# EAGLE schematic Artemis Charger Mod PCB.2 (EAGLE 7.5.0)
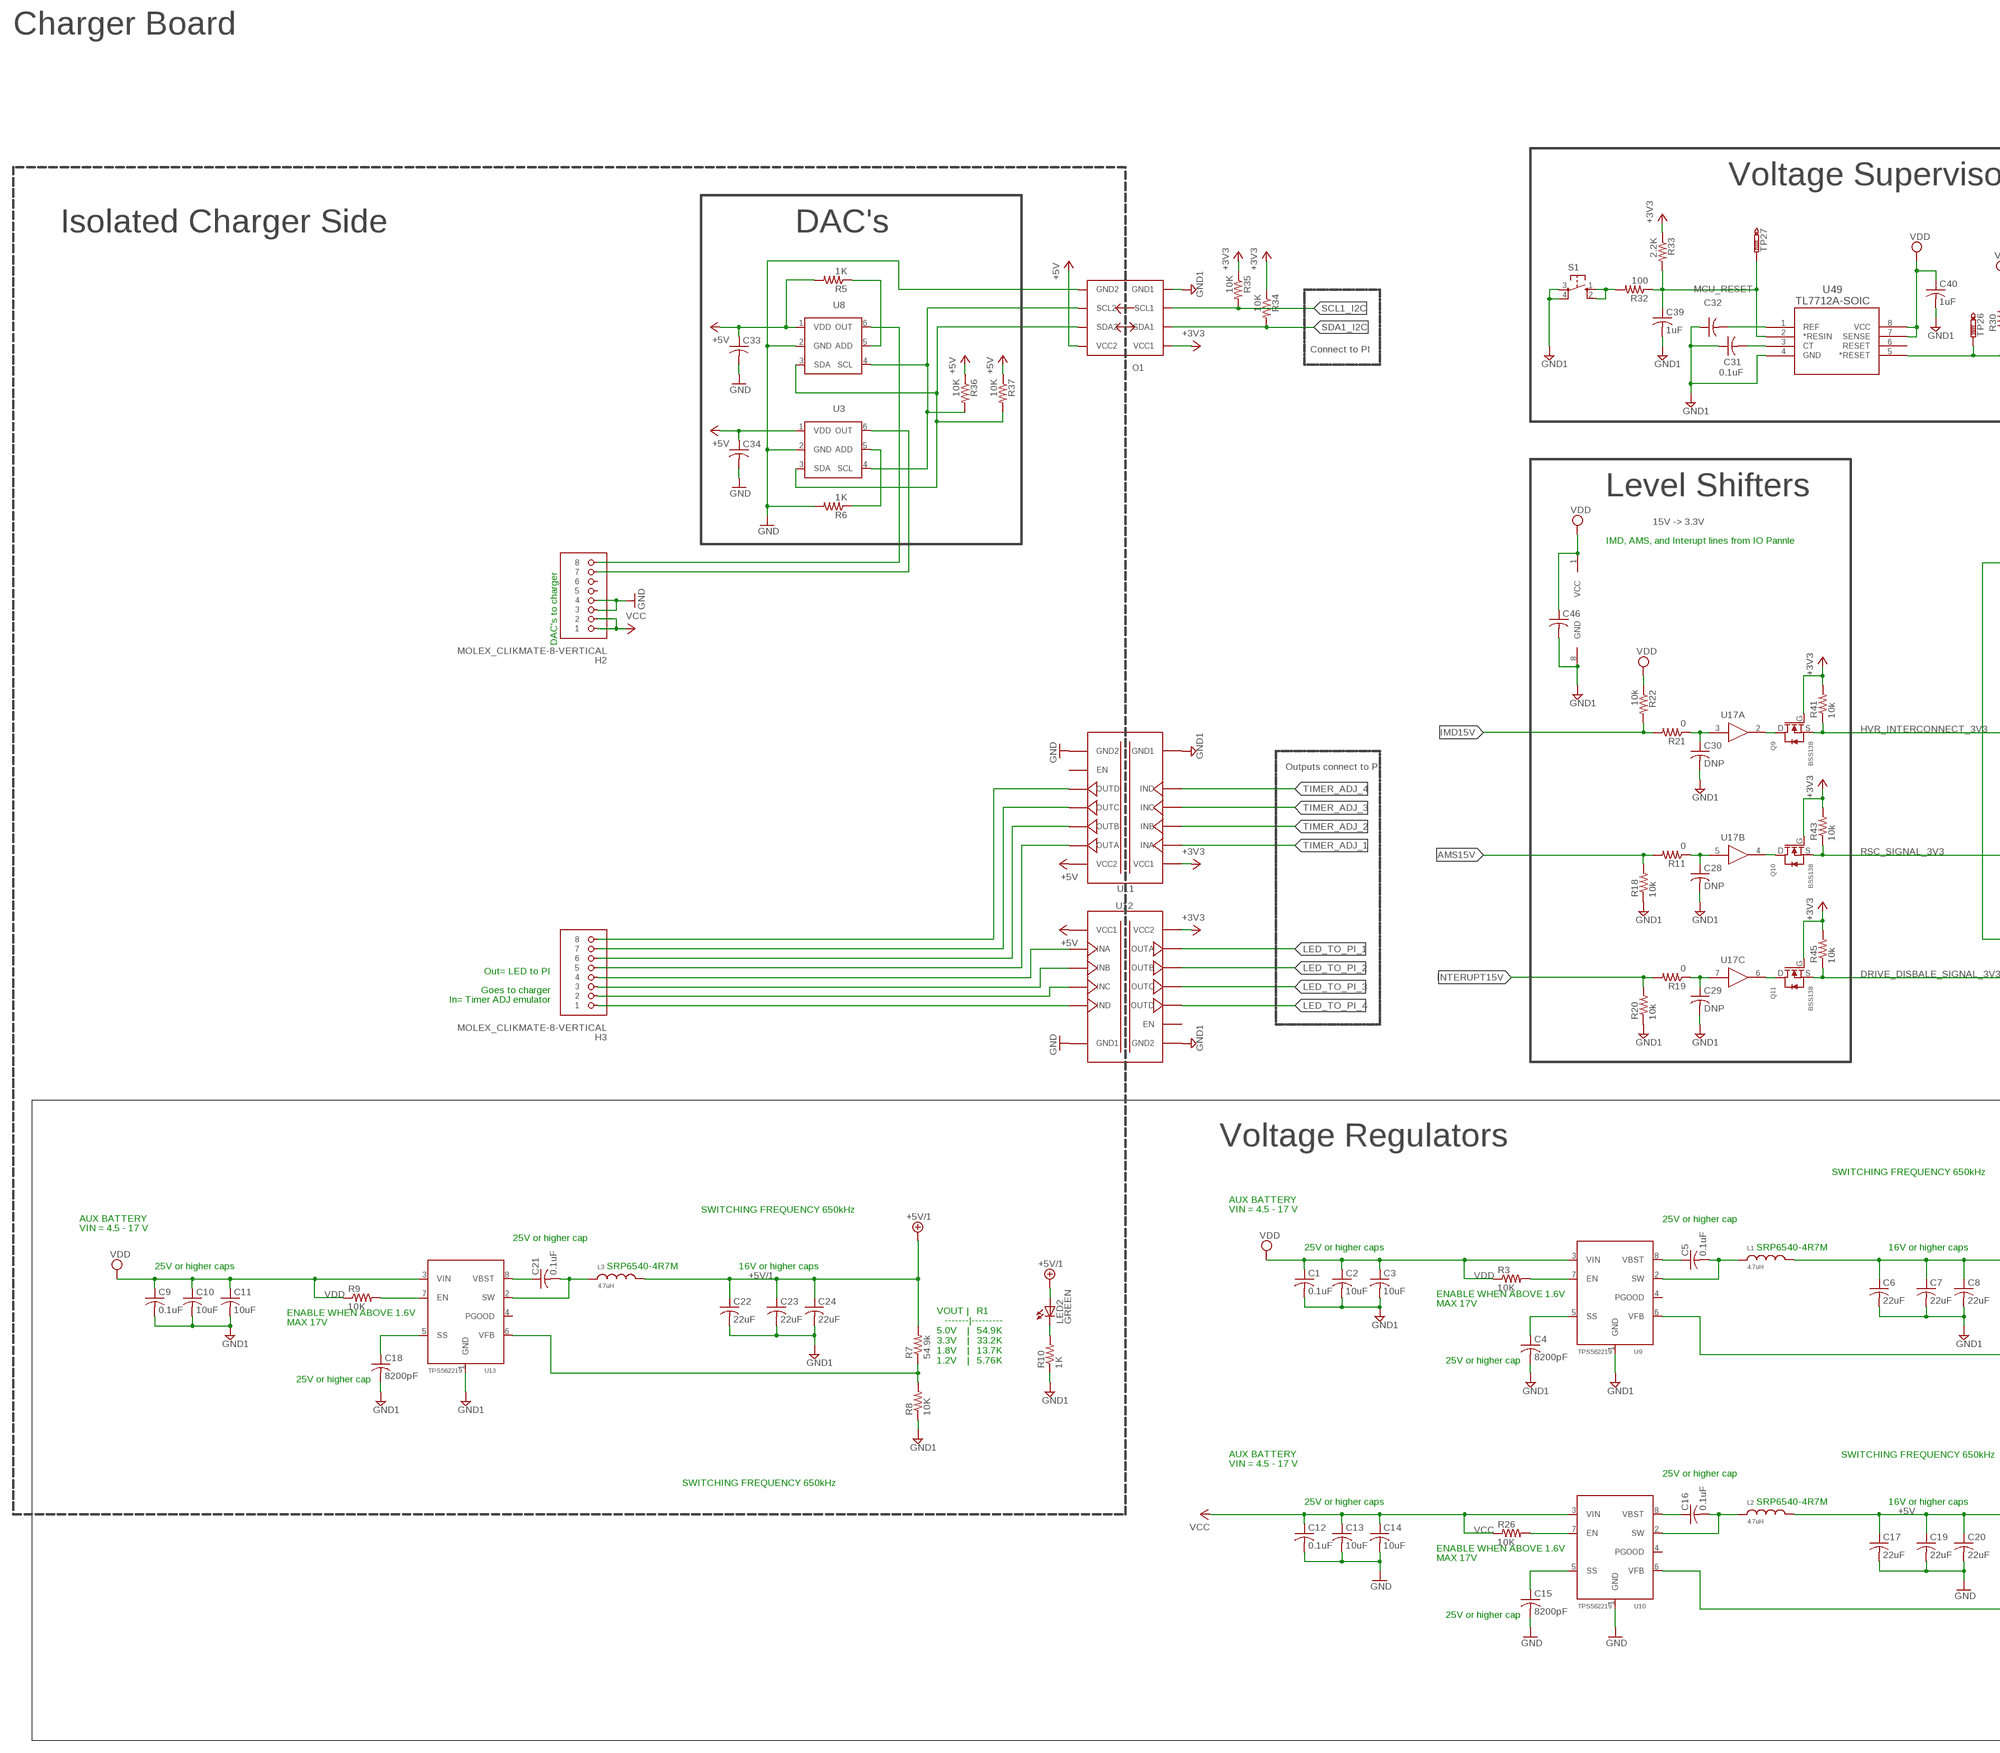
[diagram p0: schematic, sheet 1, part 1 of 2]
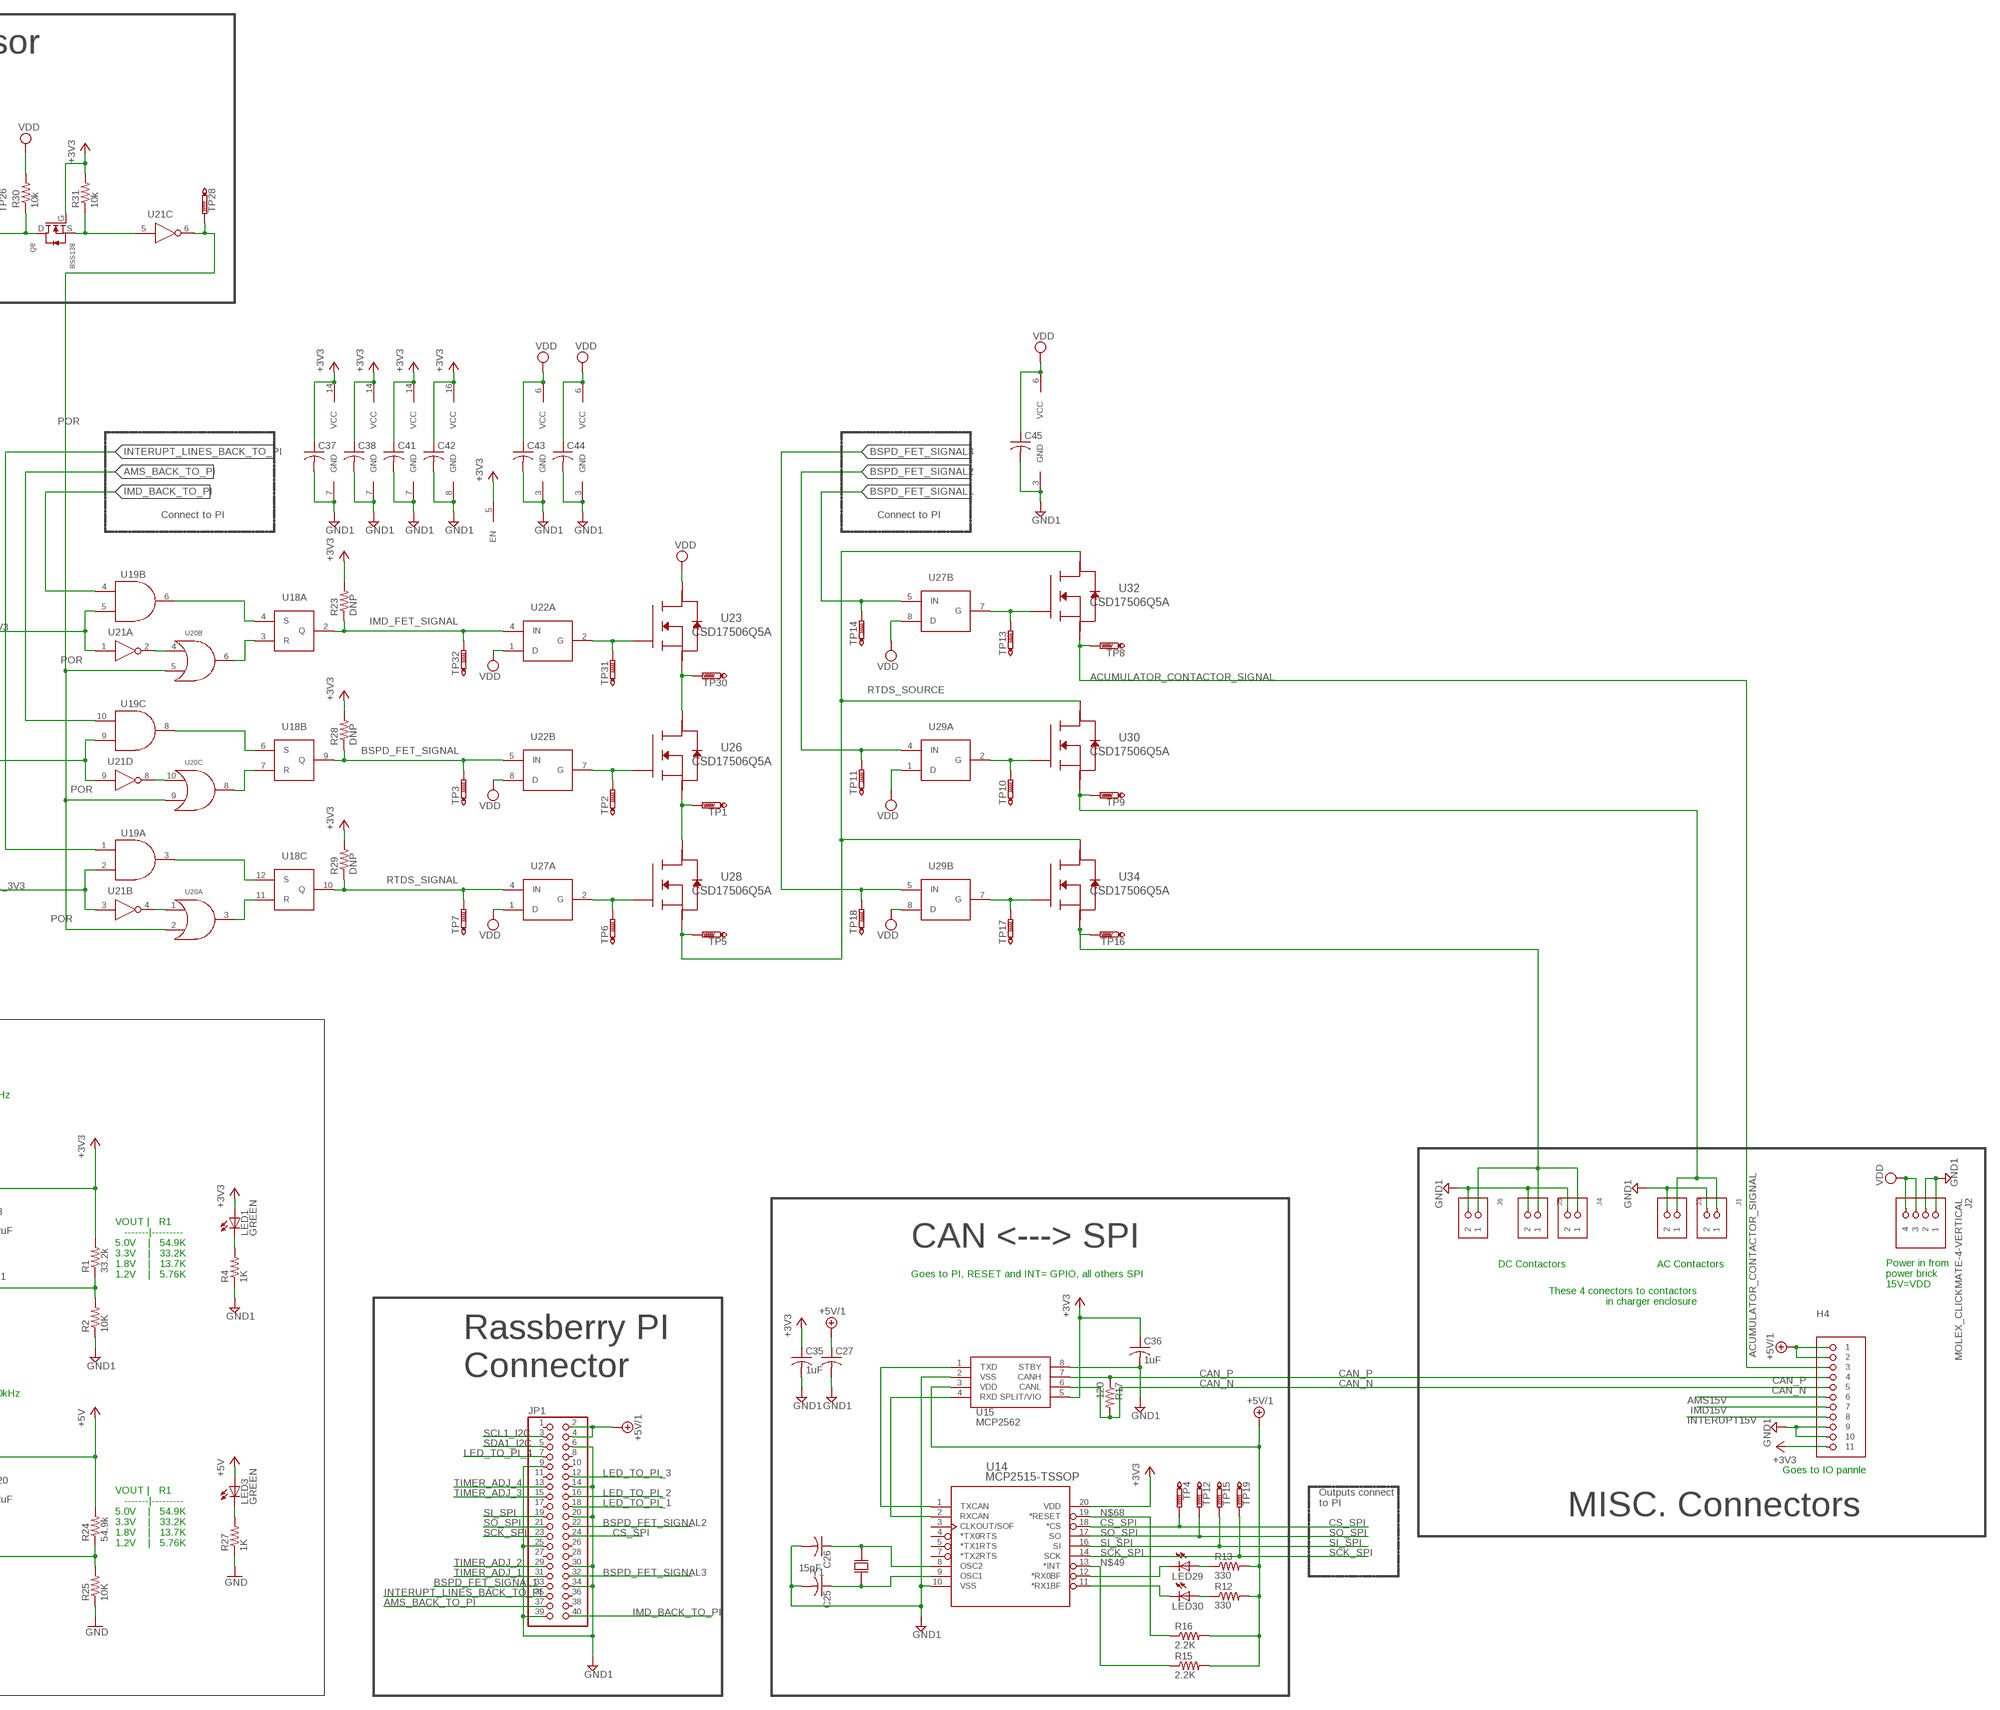
[diagram p1: schematic, sheet 1, part 2 of 2]

## Parts
C1  0.1uF  C-USC0805  [C0805]
C2  10uF  C-USC0805  [C0805]
C3  10uF  C-USC0805  [C0805]
C4  8200pF  C-USC0805  [C0805]
C5  0.1uF  C-USC0805  [C0805]
C6  22uF  C-USC0805  [C0805]
C7  22uF  C-USC0805  [C0805]
C8  22uF  C-USC0805  [C0805]
C9  0.1uF  C-USC0805  [C0805]
C10  10uF  C-USC0805  [C0805]
C11  10uF  C-USC0805  [C0805]
C12  0.1uF  C-USC0805  [C0805]
C13  10uF  C-USC0805  [C0805]
C14  10uF  C-USC0805  [C0805]
C15  8200pF  C-USC0805  [C0805]
C16  0.1uF  C-USC0805  [C0805]
C17  22uF  C-USC0805  [C0805]
C18  8200pF  C-USC0805  [C0805]
C19  22uF  C-USC0805  [C0805]
C20  22uF  C-USC0805  [C0805]
C21  0.1uF  C-USC0805  [C0805]
C22  22uF  C-USC0805  [C0805]
C23  22uF  C-USC0805  [C0805]
C24  22uF  C-USC0805  [C0805]
C25  15pF  C-USC0805  [C0805]
C26  15pF  C-USC0805  [C0805]
C27  0.1uF  C-USC0805  [C0805]
C28  DNP  C-USC0805  [C0805]
C29  DNP  C-USC0805  [C0805]
C30  DNP  C-USC0805  [C0805]
C31  0.1uF  C-USC0805  [C0805]
C32  0.1uF  C-USC0805  [C0805]
C33  0.1uF  C-USC0805  [C0805]
C34  0.1uF  C-USC0805  [C0805]
C35  1uF  C-USC0805  [C0805]
C36  1uF  C-USC0805  [C0805]
C37  0.1uF  C-USC0805  [C0805]
C38  0.1uF  C-USC0805  [C0805]
C39  1uF  C-USC0805  [C0805]
C40  1uF  C-USC0805  [C0805]
C41  0.1uF  C-USC0805  [C0805]
C42  0.1uF  C-USC0805  [C0805]
C43  0.1uF  C-USC0805  [C0805]
C44  0.1uF  C-USC0805  [C0805]
C45  0.1uF  C-USC0805  [C0805]
C46  0.1uF  C-USC0805  [C0805]
H2  MOLEX_CLIKMATE-8-VERTICAL  [MOLEX-CLIKMATE-8-VERTICAL-HEADER]
H3  MOLEX_CLIKMATE-8-VERTICAL  [MOLEX-CLIKMATE-8-VERTICAL-HEADER]
H4  MOLEX_CLICKMATE-11-VERTICAL-VERTICAL  [MOLEX_CLICKMATE-11-VERTICAL-HEADER]
J1  MOLEX_CLICKMATE-2-VERTICAL  [MOLEX-CLIKMATE-2-VERTICAL-HEADER]
J2  MOLEX_CLICKMATE-4-VERTICAL  [MOLEX-CLIKMATE-4-VERTICAL-HEADER]
J3  MOLEX_CLICKMATE-2-VERTICAL  [MOLEX-CLIKMATE-2-VERTICAL-HEADER]
J4  MOLEX_CLICKMATE-2-VERTICAL  [MOLEX-CLIKMATE-2-VERTICAL-HEADER]
J5  MOLEX_CLICKMATE-2-VERTICAL  [MOLEX-CLIKMATE-2-VERTICAL-HEADER]
J6  MOLEX_CLICKMATE-2-VERTICAL  [MOLEX-CLIKMATE-2-VERTICAL-HEADER]
JP1  PINHD-2X20  [2X20]
L1  4.7uH  SRP6540  [SRP6540]
L2  4.7uH  SRP6540  [SRP6540]
L3  4.7uH  SRP6540  [SRP6540]
LED1  GREEN  LEDCHIPLED_0805  [CHIPLED_0805]
LED2  GREEN  LEDCHIPLED_0805  [CHIPLED_0805]
LED3  GREEN  LEDCHIPLED_0805  [CHIPLED_0805]
LED29  LEDCHIP-LED0805  [CHIP-LED0805]
LED30  LEDCHIP-LED0805  [CHIP-LED0805]
O1  ISO1541  [ISO1541]
Q8  BSS138  [BSS138]
Q9  BSS138  [BSS138]
Q10  BSS138  [BSS138]
Q11  BSS138  [BSS138]
R1  33.2k  R-US_R0805  [R0805]
R2  10K  R-US_R0805  [R0805]
R3  10K  R-US_R0805  [R0805]
R4  1K  R-US_R0805  [R0805]
R5  1K  R-US_R0805  [R0805]
R6  1K  R-US_R0805  [R0805]
R7  54.9k  R-US_R0805  [R0805]
R8  10K  R-US_R0805  [R0805]
R9  10K  R-US_R0805  [R0805]
R10  1K  R-US_R0805  [R0805]
R11  0  R-US_R0805  [R0805]
R12  330  R-US_R0805  [R0805]
R13  330  R-US_R0805  [R0805]
R15  2.2K  R-US_R0805  [R0805]
R16  2.2K  R-US_R0805  [R0805]
R17  120  R-US_R0805  [R0805]
R18  10k  R-US_R0805  [R0805]
R19  0  R-US_R0805  [R0805]
R20  10k  R-US_R0805  [R0805]
R21  0  R-US_R0805  [R0805]
R22  10k  R-US_R0805  [R0805]
R23  DNP  R-US_R0805  [R0805]
R24  54.9k  R-US_R0805  [R0805]
R25  10K  R-US_R0805  [R0805]
R26  10K  R-US_R0805  [R0805]
R27  1K  R-US_R0805  [R0805]
R28  DNP  R-US_R0805  [R0805]
R29  DNP  R-US_R0805  [R0805]
R30  10k  R-US_R0805  [R0805]
R31  10k  R-US_R0805  [R0805]
R32  100  R-US_R0805  [R0805]
R33  2.2K  R-US_R0805  [R0805]
R34  10K  R-US_R0805  [R0805]
R35  10K  R-US_R0805  [R0805]
R36  10K  R-US_R0805  [R0805]
R37  10K  R-US_R0805  [R0805]
R41  10k  R-US_R0805  [R0805]
R43  10k  R-US_R0805  [R0805]
R45  10k  R-US_R0805  [R0805]
S1  TE-FSM4JSMATR  [TE-FSM4JSMATR]
TP1  PTR1TP20R  [TP20R]
TP2  PTR1TP20R  [TP20R]
TP3  PTR1TP20R  [TP20R]
TP4  PTR1TP20R  [TP20R]
TP5  PTR1TP20R  [TP20R]
TP6  PTR1TP20R  [TP20R]
TP7  PTR1TP20R  [TP20R]
TP8  PTR1TP20R  [TP20R]
TP9  PTR1TP20R  [TP20R]
TP10  PTR1TP20R  [TP20R]
TP11  PTR1TP20R  [TP20R]
TP12  PTR1TP20R  [TP20R]
TP13  PTR1TP20R  [TP20R]
TP14  PTR1TP20R  [TP20R]
TP15  PTR1TP20R  [TP20R]
TP16  PTR1TP20R  [TP20R]
TP17  PTR1TP20R  [TP20R]
TP18  PTR1TP20R  [TP20R]
TP19  PTR1TP20R  [TP20R]
TP26  PTR1TP20R  [TP20R]
TP27  PTR1TP20R  [TP20R]
TP28  PTR1TP20R  [TP20R]
TP30  PTR1TP20R  [TP20R]
TP31  PTR1TP20R  [TP20R]
TP32  PTR1TP20R  [TP20R]
U3  MAX5812LEUT+TCT-ND  MAX5812M  [MAX5812]
U8  MAX5812LEUT+TCT-ND  MAX5812M  [MAX5812]
U9  TPS562219  [TPS562219]
U10  TPS562219  [TPS562219]
U11  ISO7340  [ISO734X]
U12  ISO7340  [ISO734X]
U13  TPS562219  [TPS562219]
U14  MCP2515-TSSOP  [TSSOP20_MC]
U15  MCP2562  MCP256X-SOIC  [SOIC8-N_MC]
U17  CD4050BD  [SOIC-16]
U18  CD4043B  [PW16-M]
U19  SN74LVC08ASOIC  [D14]
U20  SN74LVC32ASOIC  [D14]
U21  SN74LVC04ASOIC  [SOIC-14]
U22  LTC1155  [LT-SOL8]
U23  CSD17506Q5A  [SON_5X6]
U26  CSD17506Q5A  [SON_5X6]
U27  LTC1155  [LT-SOL8]
U28  CSD17506Q5A  [SON_5X6]
U29  LTC1155  [LT-SOL8]
U30  CSD17506Q5A  [SON_5X6]
U32  CSD17506Q5A  [SON_5X6]
U34  CSD17506Q5A  [SON_5X6]
U49  TL7712A-SOIC  TL7709A-SOIC  [D8]
Y1  CSM-3X  [CSM-3X]

## Nets
+3V3: C6.1 C7.1 C8.1 C35.1 C36.1 C37.1 C38.1 C41.1 C42.1 H4.11 L1.P$2 LED1.A O1.1(VCC1) Q8.G Q9.G Q10.G Q11.G R1.2 R23.2 R28.2 R29.2 R31.2 R33.1 R34.1 R35.1 R41.2 R43.2 R45.2 U11.P$1(VCC1) U12.P$16(VCC2) U14.20(VDD) U15.5(SPLIT/VIO) U18.5(EN:EN) U18.16(P:VCC) U19.14(P:VCC) U20.14(P:VCC) U21.14(POWER:VCC)
+5V: C17.1 C19.1 C20.1 C33.1 C34.1 L2.P$2 LED3.A O1.8(VCC2) R5.2 R24.2 R36.1 R37.1 U3.1(VDD) U8.1(VDD) U11.P$16(VCC2) U12.P$1(VCC1)
+5V/1: C22.1 C23.1 C24.1 C27.1 H4.1 H4.2 JP1.2 JP1.4 L3.P$2 LED2.A R7.2 R12.2 R13.2 R15.2 R16.2 U15.3(VDD)
ACUMULATOR_CONTACTOR_SIGNAL: H4.3 TP8.TP U32.1(S) U32.2(S) U32.3(S)
ADD: R6.1 U3.5(ADD)
AMS15V: H4.6 R11.2 R18.2
AMS_15V_FILTERED: Q10.D U17.4(B:OUT)
AMS_BACK_TO_PI: JP1.37 U19.10(C:IN1)
BSPD_FET_SIGNAL: R28.1 TP3.TP U18.9(B:Q) U22.5(B:IN)
BSPD_FET_SIGNAL1: JP1.33 TP14.TP U27.5(B:IN)
BSPD_FET_SIGNAL2: JP1.22 TP11.TP U29.4(A:IN)
BSPD_FET_SIGNAL3: JP1.32 TP18.TP U29.5(B:IN)
CAN_N [CAN]: H4.5 R17.2 U15.6(CANL)
CAN_P [CAN]: H4.4 R17.1 U15.7(CANH)
CS_SPI: JP1.24 TP4.TP U14.18(*CS)
DRIVE_DISBALE_SIGNAL_3V3: Q11.S R45.1 U19.2(A:IN2) U21.3(B:IN)
FET_CONNECT_1: TP30.TP U23.1(S) U23.2(S) U23.3(S) U26.5(D) U26.6(D) U26.7(D) U26.8(D) U26.PAD1(D) U26.PAD(D) U26.VIA1(D) U26.VIA2(D) U26.VIA3(D) U26.VIA4(D) U26.VIA5(D) U26.VIA6(D) U26.VIA7(D) U26.VIA8(D) U26.VIA9(D)
FET_CONNECT_2: TP1.TP U26.1(S) U26.2(S) U26.3(S) U28.5(D) U28.6(D) U28.7(D) U28.8(D) U28.PAD1(D) U28.PAD(D) U28.VIA1(D) U28.VIA2(D) U28.VIA3(D) U28.VIA4(D) U28.VIA5(D) U28.VIA6(D) U28.VIA7(D) U28.VIA8(D) U28.VIA9(D)
GND: C12.2 C13.2 C14.2 C15.2 C17.2 C19.2 C20.2 C33.2 C34.2 H2.3 H2.4 O1.5(GND2) R6.2 R25.1 R27.1 U3.2(GND) U8.2(GND) U10.1(GND) U11.P$9(GND2) U11.P$15(GND2) U12.P$2(GND1) U12.P$8(GND1)
GND1: C1.2 C2.2 C3.2 C4.2 C6.2 C7.2 C8.2 C9.2 C10.2 C11.2 C18.2 C22.2 C23.2 C24.2 C25.2 C26.2 C27.2 C28.2 C29.2 C30.2 C31.1 C32.1 C35.2 C36.2 C37.2 C38.2 C39.2 C40.2 C41.2 C42.2 C43.2 C44.2 C45.2 C46.2 H4.9 H4.10 J1.2 J2.1 J2.2 J3.2 J4.2 J5.2 J6.2 JP1.6 JP1.9 JP1.14 JP1.20 JP1.25 JP1.30 JP1.34 JP1.39 O1.4(GND1) R2.1 R4.1 R8.1 R10.1 R18.1 R20.1 S1.3 S1.4 U9.1(GND) U11.P$2(GND1) U11.P$8(GND1) U12.P$9(GND2) U12.P$15(GND2) U13.1(GND) U14.10(VSS) U15.2(VSS) U15.8(STBY) U17.8(POWER:GND) U18.8(P:GND) U19.7(P:GND) U20.7(P:GND) U21.7(POWER:GND) U22.3(P:GND) U27.3(P:GND) U29.3(P:GND) U49.4(GND)
HVR_INTERCONNECT_3V3: Q9.S R41.1 U19.5(B:IN2) U21.1(A:IN)
IMD15V: H4.7 R21.2 R22.2
IMD_15V_FILTERED: Q9.D U17.2(A:OUT)
IMD_BACK_TO_PI: JP1.40 U19.4(B:IN1)
IMD_FET_SIGNAL: R23.1 TP32.TP U18.2(A:Q) U22.4(A:IN)
INTERUPT15V: H4.8 R19.2 R20.2
INTERUPT_LINES_15V_FILTERED: Q11.D U17.6(C:OUT)
INTERUPT_LINES_BACK_TO_PI: JP1.35 U19.1(A:IN1)
LED_TO_PI_1: JP1.18 U12.P$14(OUTA)
LED_TO_PI_1_C: H3.1 U12.P$6(IND)
LED_TO_PI_2: JP1.16 U12.P$13(OUTB)
LED_TO_PI_2_C: H3.2 U12.P$5(INC)
LED_TO_PI_3: JP1.12 U12.P$12(OUTC)
LED_TO_PI_3_C: H3.3 U12.P$4(INB)
LED_TO_PI_4: JP1.7 U12.P$11(OUTD)
LED_TO_PI_4_C: H3.4 U12.P$3(INA)
MCU_RESET: C39.1 R32.1 R33.2 TP27.TP U49.2(*RESIN)
N$1: R3.2 U9.7(EN)
N$2: LED1.C R4.2
N$4: R5.1 U8.5(ADD)
N$6: J4.1 J5.1 J6.1 TP16.TP U34.1(S) U34.2(S) U34.3(S)
N$8: U20.1(A:IN1) U21.4(B:OUT)
N$9: U20.4(B:IN1) U21.2(A:OUT)
N$13: U18.12(C:S) U19.3(A:OUT)
N$17: U18.11(C:R) U20.3(A:OUT)
N$19: U18.3(A:R) U20.6(B:OUT)
N$20: U18.4(A:S) U19.6(B:OUT)
N$21: U20.10(C:IN1) U21.8(D:OUT)
N$22: U18.6(B:S) U19.8(C:OUT)
N$23: U18.7(B:R) U20.8(C:OUT)
N$25: H2.7 U3.6(OUT)
N$26: H2.8 U8.6(OUT)
N$28: LED3.C R27.2
N$30: H3.5 U11.P$14(OUTA)
N$31: H3.6 U11.P$13(OUTB)
N$32: H3.7 U11.P$12(OUTC)
N$33: H3.8 U11.P$11(OUTD)
N$43: C28.1 R11.1 U17.5(B:IN)
N$44: R9.2 U13.7(EN)
N$45: LED2.C R10.2
N$46: U14.2(RXCAN) U15.4(RXD)
N$47: U14.1(TXCAN) U15.1(TXD)
N$49: R15.1 U14.13(*INT)
N$50: C29.1 R19.1 U17.7(C:IN)
N$53: C30.1 R21.1 U17.3(A:IN)
N$54: TP31.TP U22.2(A:G) U23.4(G)
N$55: TP2.TP U22.7(B:G) U26.4(G)
N$56: TP6.TP U27.2(A:G) U28.4(G)
N$57: TP10.TP U29.2(A:G) U30.4(G)
N$58: Q8.S R31.1 U21.5(C:IN)
N$59: TP13.TP U27.7(B:G) U32.4(G)
N$61: Q8.D R30.1 TP26.TP U49.5(*RESET)
N$62: R32.2 S1.1 S1.2
N$64: TP17.TP U29.7(B:G) U34.4(G)
N$68: R16.1 U14.19(*RESET)
N$77: LED30.C U14.11(*RX1BF)
N$80: LED29.C U14.12(*RX0BF)
N$99: LED30.A R12.1
N$100: LED29.A R13.1
N$123: C26.1 U14.8(OSC2) Y1.P$1
N$124: C25.1 U14.9(OSC1) Y1.P$2
N$189: C31.2 U49.3(CT)
N$190: C32.2 U49.1(REF)
N$1001: R26.2 U10.7(EN)
POR: TP28.TP U20.2(A:IN2) U20.5(B:IN2) U20.9(C:IN2) U21.6(C:OUT)
RSC_SIGNAL_3V3: Q10.S R43.1 U19.9(C:IN2) U21.9(D:IN)
RTDS_SIGNAL: R29.1 TP7.TP U18.10(C:Q) U27.4(A:IN)
RTDS_SOURCE: TP5.TP U28.1(S) U28.2(S) U28.3(S) U30.5(D) U30.6(D) U30.7(D) U30.8(D) U30.PAD1(D) U30.PAD(D) U30.VIA1(D) U30.VIA2(D) U30.VIA3(D) U30.VIA4(D) U30.VIA5(D) U30.VIA6(D) U30.VIA7(D) U30.VIA8(D) U30.VIA9(D) U32.5(D) U32.6(D) U32.7(D) U32.8(D) U32.PAD1(D) U32.PAD(D) U32.VIA1(D) U32.VIA2(D) U32.VIA3(D) U32.VIA4(D) U32.VIA5(D) U32.VIA6(D) U32.VIA7(D) U32.VIA8(D) U32.VIA9(D) U34.5(D) U34.6(D) U34.7(D) U34.8(D) U34.PAD1(D) U34.PAD(D) U34.VIA1(D) U34.VIA2(D) U34.VIA3(D) U34.VIA4(D) U34.VIA5(D) U34.VIA6(D) U34.VIA7(D) U34.VIA8(D) U34.VIA9(D)
RTDS_SOURCE1: J1.1 J3.1 TP9.TP U30.1(S) U30.2(S) U30.3(S)
SCK_SPI: JP1.23 TP19.TP U14.14(SCK)
SCL: O1.6(SCL2) R36.2 U3.4(SCL) U8.4(SCL)
SCL1_I2C: JP1.3 O1.3(SCL1) R35.2
SDA: O1.7(SDA2) R37.2 U3.3(SDA) U8.3(SDA)
SDA1_I2C: JP1.5 O1.2(SDA1) R34.2
SI_SPI: JP1.19 TP15.TP U14.16(SI)
SO_SPI: JP1.21 TP12.TP U14.17(SO)
SS_3V3: C4.1 U9.5(SS)
SS_5V: C15.1 U10.5(SS)
SS_5V2: C18.1 U13.5(SS)
SW_3V3: C5.2 L1.P$1 U9.2(SW)
SW_5V: C16.2 L2.P$1 U10.2(SW)
SW_5V/1: C21.2 L3.P$1 U13.2(SW)
TIMER_ADJ_1: JP1.31 U11.P$3(INA)
TIMER_ADJ_2: JP1.29 U11.P$4(INB)
TIMER_ADJ_3: JP1.15 U11.P$5(INC)
TIMER_ADJ_4: JP1.13 U11.P$6(IND)
VBST_3V3: C5.1 U9.8(VBST)
VBST_5V: C16.1 U10.8(VBST)
VBST_5V/1: C21.1 U13.8(VBST)
VCC: C12.1 C13.1 C14.1 H2.1 H2.2 R26.1 U10.3(VIN)
VDD: C1.1 C2.1 C3.1 C9.1 C10.1 C11.1 C40.1 C43.1 C44.1 C45.1 C46.1 J2.3 J2.4 R3.1 R9.1 R22.1 R30.2 U9.3(VIN) U13.3(VIN) U17.1(POWER:VCC) U22.1(A:D) U22.6(P:VCC) U22.8(B:D) U23.5(D) U23.6(D) U23.7(D) U23.8(D) U23.PAD1(D) U23.PAD(D) U23.VIA1(D) U23.VIA2(D) U23.VIA3(D) U23.VIA4(D) U23.VIA5(D) U23.VIA6(D) U23.VIA7(D) U23.VIA8(D) U23.VIA9(D) U27.1(A:D) U27.6(P:VCC) U27.8(B:D) U29.1(A:D) U29.6(P:VCC) U29.8(B:D) U49.7(SENSE) U49.8(VCC)
VFB_3V3: R1.1 R2.2 U9.6(VFB)
VFB_5V: R24.1 R25.2 U10.6(VFB)
VFB_5V/1: R7.1 R8.2 U13.6(VFB)
Unconnected: H2.5 H2.6 JP1.1 JP1.8 JP1.10 JP1.11 JP1.17 JP1.26 JP1.27 JP1.28 JP1.36 JP1.38 U9.4(PGOOD) U10.4(PGOOD) U11.P$10(EN) U12.P$10(EN) U13.4(PGOOD) U14.3(CLKOUT/SOF) U14.4(*TX0RTS) U14.5(*TX1RTS) U14.7(*TX2RTS) U17.9(D:IN) U17.10(D:OUT) U17.11(E:IN) U17.12(E:OUT) U17.14(F:IN) U17.15(F:OUT) U18.1(D:Q) U18.14(D:S) U18.15(D:R) U19.11(D:OUT) U19.12(D:IN2) U19.13(D:IN1) U20.11(D:OUT) U20.12(D:IN2) U20.13(D:IN1) U21.10(E:OUT) U21.11(E:IN) U21.12(F:OUT) U21.13(F:IN) U49.6(RESET)

## Notes on the sheet
- Charger Board
- Voltage Supervisor
- Isolated Charger Side | DAC's
- Connect to PI
- Level Shifters
- 15V -> 3.3V
- IMD, AMS, and Interupt lines from IO Pannle
- DAC's to charger
- Connect to PI | Connect to PI
- Outputs connect to PI
- Out= LED to PI
- Goes to charger
  In= Timer ADJ emulator
- Voltage Regulators
- SWITCHING FREQUENCY 650kHz
- SWITCHING FREQUENCY 650kHz
- AUX BATTERY
  VIN = 4.5 - 17 V
- 25V or higher cap
- AUX BATTERY
  VIN = 4.5 - 17 V
- 25V or higher cap
- 25V or higher caps | SRP6540-4R7M | 16V or higher caps
- 25V or higher caps | SRP6540-4R7M | 16V or higher caps
- ENABLE WHEN ABOVE 1.6V
  MAX 17V
- CAN <---> SPI
- ENABLE WHEN ABOVE 1.6V
  MAX 17V
- DC Contactors | AC Contactors
- VOUT |   R1
     -------|---------
  5.0V    |   54.9K
  3.3V    |   33.2K
  1.8V    |   13.7K
  1.2V    |   5.76K
- Goes to PI, RESET and INT= GPIO, all others SPI
- These 4 conectors to contactors
        in charger enclosure
- Power in from
  power brick
  15V=VDD
- VOUT |   R1
     -------|---------
  5.0V    |   54.9K
  3.3V    |   33.2K
  1.8V    |   13.7K
  1.2V    |   5.76K
- 25V or higher cap
- 25V or higher cap
- Rassberry PI
  Connector
- SWITCHING FREQUENCY 650kHz
- AUX BATTERY
  VIN = 4.5 - 17 V
- 25V or higher cap
- SWITCHING FREQUENCY 650kHz
- 25V or higher caps | SRP6540-4R7M | 16V or higher caps
- Goes to IO pannle
- ENABLE WHEN ABOVE 1.6V
  MAX 17V
- Outputs connect
  to PI
- MISC. Connectors
- VOUT |   R1
     -------|---------
  5.0V    |   54.9K
  3.3V    |   33.2K
  1.8V    |   13.7K
  1.2V    |   5.76K
- 25V or higher cap

## Library data of the parts
C1 C5 C12 C16 C21 = adafruit:C-US: CAPACITOR, American symbol; PARTNO: GRM21BR71E104KA01L
C2 C3 C10 C11 C13 C14 = adafruit:C-US: CAPACITOR, American symbol; PARTNO: GRM21BR61E106KA73L
C4 C15 C18 = adafruit:C-US: CAPACITOR, American symbol; PARTNO: C0805C822K5RACTU
C6-C8 C17 C19 C20 C22-C24 = adafruit:C-US: CAPACITOR, American symbol; PARTNO: C2012JB1E226M125AC
C9 = adafruit:C-US: CAPACITOR, American symbol; PARTNO: 5025841170
C25 C26 = rcl:C-US: CAPACITOR, American symbol; MPN: 08051A150JAT2A; OC_NEWARK: 96M1322; PARTNO: CL21C150JBANNNC
C27 C33 C34 C37 C38 C41-C46 = rcl:C-US: CAPACITOR, American symbol; MPN: C1005X7R1E104K050BB; OC_NEWARK: 04X3227; PARTNO: GRM21BR71E104KA01L
C28-C30 = rcl:C-US: CAPACITOR, American symbol
C31 C32 = adafruit:C-US: CAPACITOR, American symbol; MPN: C2012X7R1H104K085AA; OC_NEWARK: 04X3288; PARTNO: GRM21BR71E104KA01L
C35 C36 C39 C40 = rcl:C-US: CAPACITOR, American symbol; PARTNO: EMK212B7105KG-T
H2 H3 = FormE:MOLEX_CLIKMATE-8-VERTICAL: 505405-0860; PARTNO: 5025840870
H4 = FormE:MOLEX_CLICKMATE-11-VERTICAL; PARTNO: 5025841170
J1 J3-J6 = FormE:MOLEX_CLICKMATE-2-VERTICAL: 5025840270; PARTNO: 5025840270
J2 = FormE:MOLEX_CLICKMATE-4-VERTICAL: 5025840470; PARTNO: 5040500491
JP1 = pinhead:PINHD-2X20: PIN HEADER; PARTNO: 68602-220HLF
L1-L3 = FormE:SRP6540; PARTNO: SRP6540-4R7M
LED1-LED3 = FormE:LED: LED OSRAM: - CHIPLED LG R971, LG N971, LY N971, LG Q971, LY Q971, LO R971, LY R971 LH N974, LH R974 LS Q976, LO Q976, LY Q976 LO Q996 - Hyper CHIPLED LW Q18S LB Q993, LB Q99A, LB R99A - SideLED LS A670, LO A670, LY A670, LG A670, LP A670 LB A673, LV A673, LT A673, LW A673 LH A674 LY A675 LS A676, LA A676, LO A676, LY A676, LW A676 LS A679, LY A679, LG A679 - Hyper Micro SIDELED® LS Y876, LA Y876, LO Y876, LY Y876 LT Y87S - SmartLED LW L88C, LW L88S LB L89C, LB L89S, LG L890 LS L89K, LO L89K, LY L89K LS L896, LA L896, LO L896, LY L896 - TOPLED LS T670, LO T670, LY T670, LG T670, LP T670 LSG T670, LSP T670, LSY T670, LOP T670, LYG T670 LG T671, LOG T671, LSG T671 LB T673, LV T673, LT T673, LW T673 LH T674 LS T676, LA T676, LO T676, LY T676, LB T676, LH T676, LSB T676, LW T676 LB T67C, LV T67C, LT T67C, LS T67K, LO T67K, LY T67K, LW E67C LS E67B, LA E67B, LO E67B, LY E67B, LB E67C, LV E67C, LT E67C LW T67C LS T679, LY T679, LG T679 LS T770, LO T770, LY T770, LG T770, LP T770 LB T773, LV T773, LT T773, LW T773 LH T774 LS E675, LA E675, LY E675, LS T675 LS T776, LA T776, LO T776, LY T776, LB T776 LHGB T686 LT T68C, LB T68C - Hyper Mini TOPLED® LB M676 - Mini TOPLED Santana® LG M470 LS M47K, LO M47K, LY M47K Source: http://www.osram.convergy.de/; PARTNO: 598-8170-107F
LED29 LED30 = adafruit:LED: LED OSRAM: - CHIPLED LG R971, LG N971, LY N971, LG Q971, LY Q971, LO R971, LY R971 LH N974, LH R974 LS Q976, LO Q976, LY Q976 LO Q996 - Hyper CHIPLED LW Q18S LB Q993, LB Q99A, LB R99A - SideLED LS A670, LO A670, LY A670, LG A670, LP A670 LB A673, LV A673, LT A673, LW A673 LH A674 LY A675 LS A676, LA A676, LO A676, LY A676, LW A676 LS A679, LY A679, LG A679 - Hyper Micro SIDELED® LS Y876, LA Y876, LO Y876, LY Y876 LT Y87S - SmartLED LW L88C, LW L88S LB L89C, LB L89S, LG L890 LS L89K, LO L89K, LY L89K LS L896, LA L896, LO L896, LY L896 - TOPLED LS T670, LO T670, LY T670, LG T670, LP T670 LSG T670, LSP T670, LSY T670, LOP T670, LYG T670 LG T671, LOG T671, LSG T671 LB T673, LV T673, LT T673, LW T673 LH T674 LS T676, LA T676, LO T676, LY T676, LB T676, LH T676, LSB T676, LW T676 LB T67C, LV T67C, LT T67C, LS T67K, LO T67K, LY T67K, LW E67C LS E67B, LA E67B, LO E67B, LY E67B, LB E67C, LV E67C, LT E67C LW T67C LS T679, LY T679, LG T679 LS T770, LO T770, LY T770, LG T770, LP T770 LB T773, LV T773, LT T773, LW T773 LH T774 LS E675, LA E675, LY E675, LS T675 LS T776, LA T776, LO T776, LY T776, LB T776 LHGB T686 LT T68C, LB T68C - Hyper Mini TOPLED® LB M676 - Mini TOPLED Santana® LG M470 LS M47K, LO M47K, LY M47K Source: http://www.osram.convergy.de/; OC_NEWARK: unknown; PARTNO: 598-8170-107F
O1 = FormE:ISO1541; PARTNO: ISO1541DR
Q8-Q11 = FormE:BSS138; PARTNO: BSS138
R1 = adafruit:R-US_: RESISTOR, American symbol; PARTNO: 1676307-2
R2 R3 R8 R9 R25 R26 R34-R37 = adafruit:R-US_: RESISTOR, American symbol; PARTNO: ERJ-6ENF1002V
R4-R6 R10 R27 = adafruit:R-US_: RESISTOR, American symbol; PARTNO: ERJ-6ENF1001V
R7 R24 = adafruit:R-US_: RESISTOR, American symbol; PARTNO: ERA-6AEB5492V
R11 R19 R21 = rcl:R-US_: RESISTOR, American symbol; PARTNO: ERJ-6GEY0R00V
R12 R13 = adafruit:R-US_: RESISTOR, American symbol; OC_NEWARK: unknown; PARTNO: ERJ-P6WF3300V
R15 R16 = adafruit:R-US_: RESISTOR, American symbol; OC_NEWARK: unknown; PARTNO: ERA-6AEB222V
R17 = adafruit:R-US_: RESISTOR, American symbol; OC_NEWARK: unknown; PARTNO: ERJ-6ENF1200V
R18 R20 R22 R30 R31 R41 R43 R45 = rcl:R-US_: RESISTOR, American symbol; PARTNO: ERJ-6ENF1002V
R23 R28 R29 = rcl:R-US_: RESISTOR, American symbol
R32 = rcl:R-US_: RESISTOR, American symbol; PARTNO: ERJ-6ENF1000V
R33 = rcl:R-US_: RESISTOR, American symbol; PARTNO: ERA-6AEB222V
S1 = FormE:TE-FSM4JSMATR; PARTNO: FSM4JSMATR
TP1-TP19 TP26-TP28 TP30-TP32 = testpad:PTR1: TEST PIN
U3 U8 = FormE:MAX5812; PARTNO: MAX5812LEUT+T
U9 U10 U13 = FormE:TPS562219; PARTNO: TPS562219DDFT
U11 U12 = FormE:ISO7340; PARTNO: ISO7340CDWR
U14 = FormE:MCP2515: MCP2515 CAN Interface via SPI; MPN: MCP2515-E/ST; OC_NEWARK: 11N7996; PARTNO: MCP2515-E/ST
U15 = FormE:MCP256X: MCP2561/2 CAN Transceiver Microchip High-Speed CAN Transceiver Datasheet <http://ww1.microchip.com/downloads/en/DeviceDoc/20005167C.pdf>; MPN: MCP2562-E/SN; OC_NEWARK: 85W9074; PARTNO: MCP2562-E/SN
U17 = FormE:CD4050B; PARTNO: CD4050BDR
U18 = FormE:CD4043B; PARTNO: CD4043BPWR
U19 = FormE:SN74LVC08A: LVC - Quad 2-Input AND; PARTNO: SN74LVC08ADR
U20 = FormE:SN74LVC32A: LVC - Quad 2-Input OR; PARTNO: SN74LVC32ADR
U21 = FormE:SN74LVC04A: LVC - Hex Inverter; PARTNO: SN74LVC04ADR
U22 U27 U29 = FormE:LTC1155; PARTNO: LTC1155CS8#PBF
U23 U26 U28 U30 U32 U34 = FormE:CSD17506Q5A; PARTNO: CSD17506Q5A
U49 = FormE:TL7709A; DATASHEETURL: http://www.ti.com/lit/gpn/TL7709A; DESCRIPTION: Single Supply Voltage Supervisor ror 5V Systems with Programmable Time Delay; FAMILY_NAME: SUPERVISOR AND RESET IC; GENERIC_PART_NUMBER: TL7709A; INDUSTRY_STD_PKG_TYPE: SOIC; MANUFACTURER: Texas Instruments; MANUFACTURER_PART_NUMBER: tl7705b_d_8; MPN: TL7705BID; OC_NEWARK: 96W3363; PACKAGE_DESIGNATOR: D; PARTNO: TL7712ACDR; PIN_COUNT: 8; VENDOR: Texas Instruments
Y1 = FormE:CSM-3X; PARTNO: ECS-160-20-3X-TR

## Net classes
1 CAN: width 0.254 mm, clearance 0.254 mm